# EAGLE schematic Stereopi Page 2 (EAGLE 9.6.2)
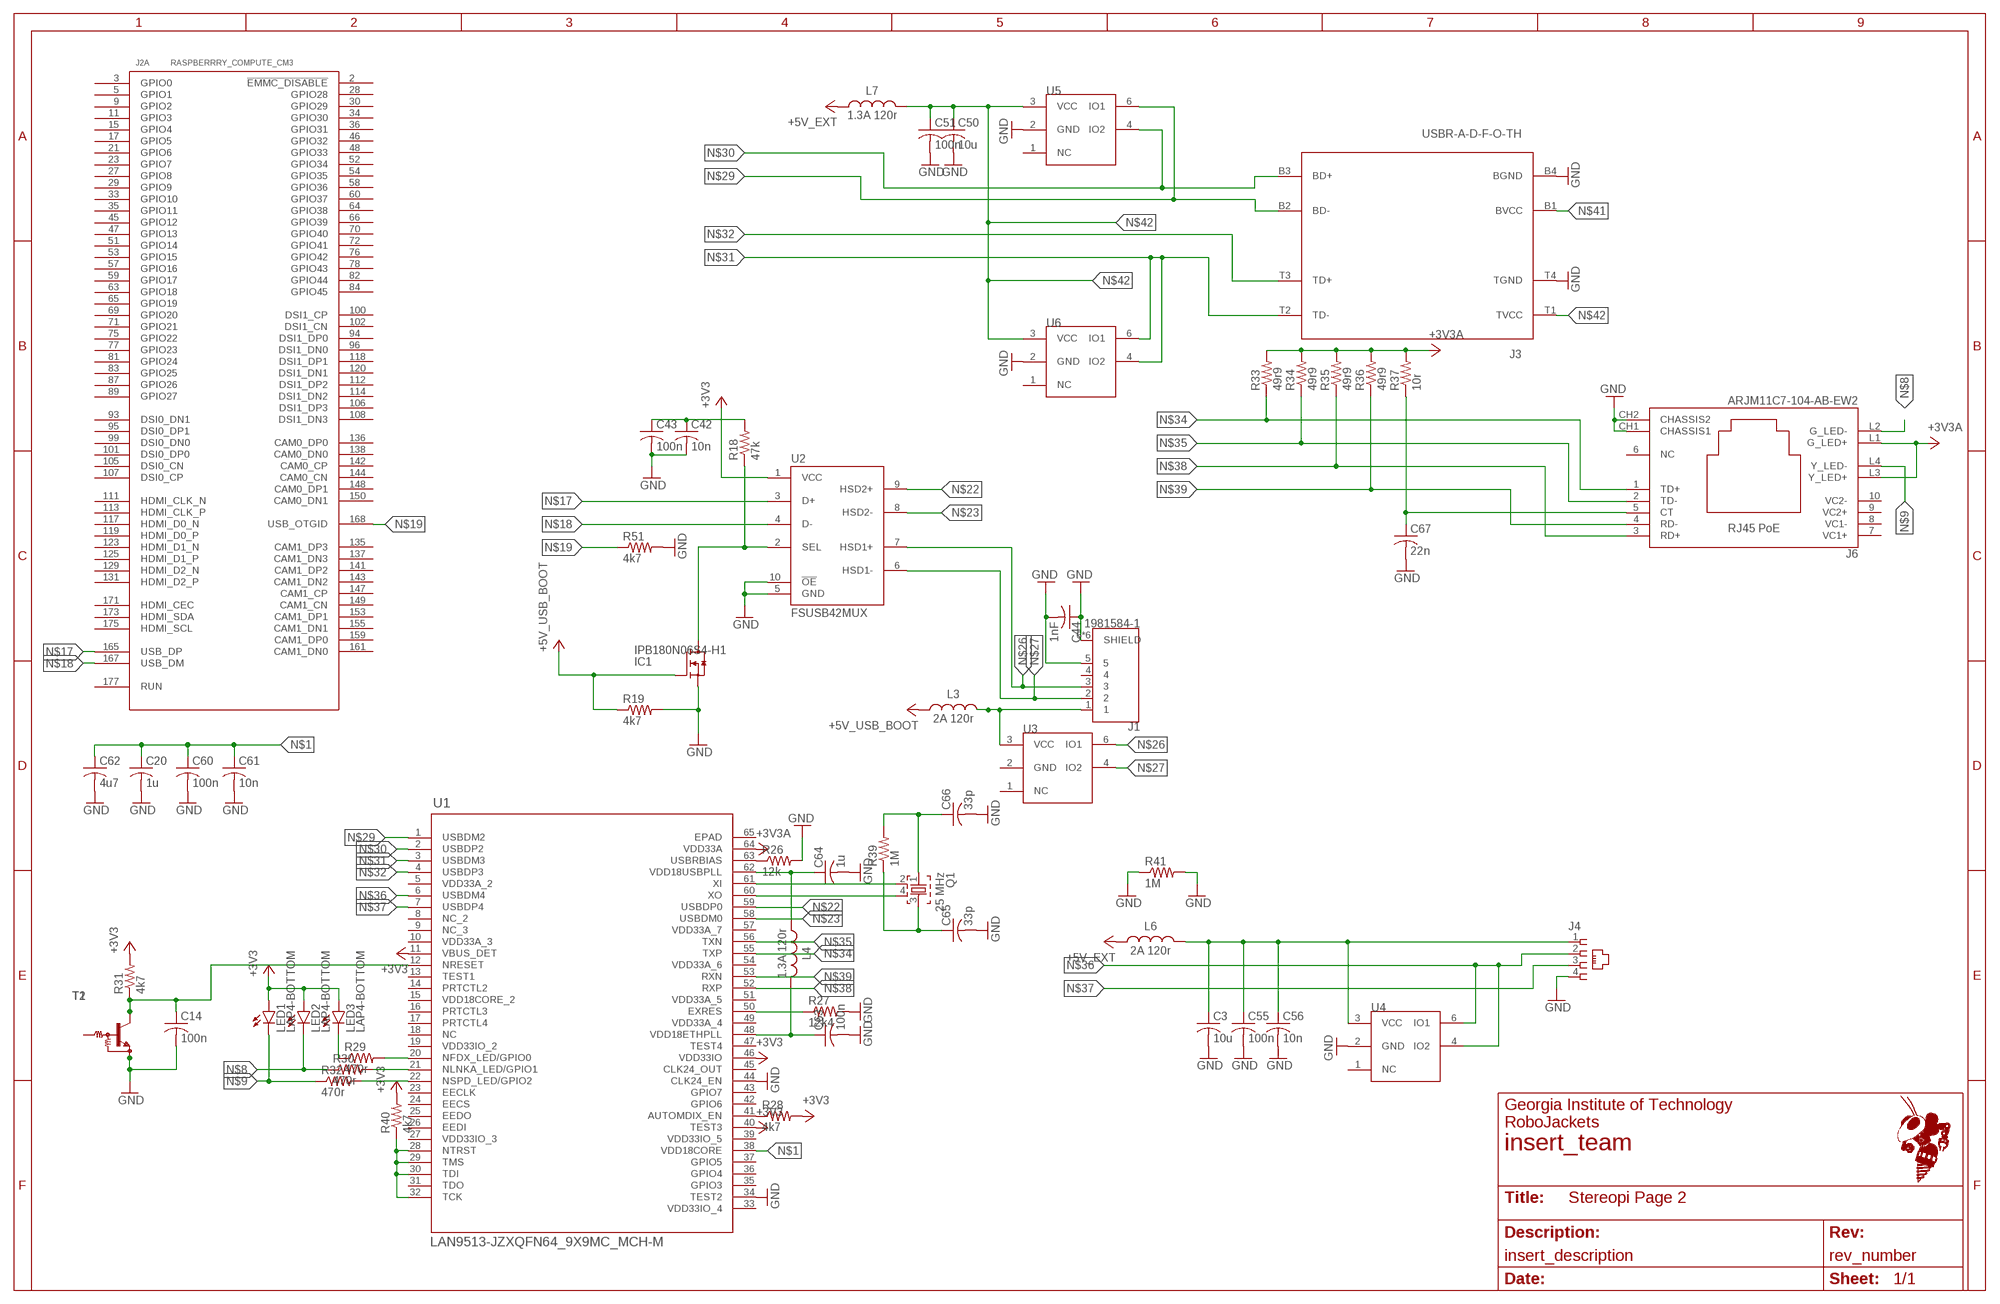
[diagram p0: schematic, sheet 1]
FRAME1 (FRAME_11_17): REVISION: rev_number; SCH_DESC: insert_description; TEAM: insert_team

## Parts
C3  10u  C-USC0402  [C0402]
C14  100n  C-USC0402  [C0402]
C20  1u  C-USC0402  [C0402]
C42  10n  C-USC0402  [C0402]
C43  100n  C-USC0402  [C0402]
C44  1nF  C-USC0402  [C0402]
C50  10u  C-USC0402  [C0402]
C51  100n  C-USC0402  [C0402]
C55  100n  C-USC0402  [C0402]
C56  10n  C-USC0402  [C0402]
C60  100n  C-USC0402  [C0402]
C61  10n  C-USC0402  [C0402]
C62  4u7  C-USC0402  [C0402]
C63  100n  C-USC0402  [C0402]
C64  1u  C-USC0402  [C0402]
C65  33p  C-USC0402  [C0402]
C66  33p  C-USC0402  [C0402]
C67  22n  C-USC0402  [C0402]
IC1  IPB180N06S4-H1  [PG-TO263-7-3]
J1  1981584-1  [TE_1981584-1]
J2  RASPBERRRY_COMPUTE_CM3  [TE_1473149-4_WITH_CM3PLUS]
J3  USBR-A-D-F-O-TH  [USBR-A-D-F-O-TH]
J4  215875-3  [215875-3]
J6  ARJM11C7-104-AB-EW2  [CONN_EW_ABR]
L3  2A 120r  INDUCTOR_0805  [0805]
L4  1.3A 120r  INDUCTOR_0805  [0805]
L6  2A 120r  INDUCTOR_0805  [0805]
L7  1.3A 120r  INDUCTOR_0805  [0805]
LED1  LAP4-BOTTOM  [P47F-BOTTOM]
LED2  LAP4-BOTTOM  [P47F-BOTTOM]
LED3  LAP4-BOTTOM  [P47F-BOTTOM]
Q1  25 MHz  FA-20H  [FA-20H]
R18  47k  ERJ-L06KF50MV  [RC0805N]
R19  4k7  ERJ-L06KF50MV  [RC0805N]
R26  12k  ERJ-L06KF50MV  [RC0805N]
R27  12k4  ERJ-L06KF50MV  [RC0805N]
R28  4k7  ERJ-L06KF50MV  [RC0805N]
R29  470r  ERJ-L06KF50MV  [RC0805N]
R30  470r  ERJ-L06KF50MV  [RC0805N]
R31  4k7  ERJ-L06KF50MV  [RC0805N]
R32  470r  ERJ-L06KF50MV  [RC0805N]
R33  49r9  ERJ-L06KF50MV  [RC0805N]
R34  49r9  ERJ-L06KF50MV  [RC0805N]
R35  49r9  ERJ-L06KF50MV  [RC0805N]
R36  49r9  ERJ-L06KF50MV  [RC0805N]
R37  10r  ERJ-L06KF50MV  [RC0805N]
R39  1M  ERJ-L06KF50MV  [RC0805N]
R40  4k7  ERJ-L06KF50MV  [RC0805N]
R41  1M  ERJ-L06KF50MV  [RC0805N]
R51  4k7  ERJ-L06KF50MV  [RC0805N]
T1  MUN2211T1-NPN_DRIVER-SC59-BEC  [SC59-BEC]
T2  MUN2211T1-NPN_DRIVER-SC59-BEC  [SC59-BEC]
U1  LAN9513-JZXQFN64_9X9MC_MCH-M  [QFN64_9X9MC_MCH-M]
U2  FSUSB42MUX  [10-MSOP]
U3  SP3003-02  [SC70-5]
U4  SP3003-02  [SC70-5]
U5  SP3003-02  [SC70-5]
U6  SP3003-02  [SC70-5]

## Nets
GND: C3.2 C14.2 C20.2 C42.2 C43.2 C44.1 C44.2 C50.2 C51.2 C55.2 C56.2 C60.2 C61.2 C62.2 C63.2 C64.2 C65.2 C66.2 C67.2 IC1.2(S) IC1.3(S) IC1.5(S) IC1.6(S) IC1.7(S) J1.5 J1.6(SHIELD) J1.7(SHIELD) J1.8(SHIELD) J1.9(SHIELD) J1.10(SHIELD) J1.11(SHIELD) J3.B4(BGND) J3.T4(TGND) J4.4 J6.CH1(CHASSIS1) J6.CH2(CHASSIS2) R19.2(PIN2) R26.2(PIN2) R27.2(PIN2) R41.1(PIN1) R41.2(PIN2) R51.2(PIN2) T1.E T2.E U1.34(TEST2) U1.44(CLK24_EN) U2.5(GND) U2.10(!OE) U4.2(GND) U5.2(GND) U6.2(GND)
N$1: C20.1 C60.1 C61.1 C62.1 U1.38(VDD18CORE)
N$2: C64.1 L4.1 U1.62(VDD18USBPLL)
N$3: C63.1 L4.2 U1.48(VDD18ETHPLL)
N$4: R29.2(PIN2) U1.20(NFDX_LED/GPIO0)
N$5: R30.2(PIN2) U1.21(NLNKA_LED/GPIO1)
N$6: R32.2(PIN2) U1.22(NSPD_LED/GPIO2)
N$7: LED3.C R29.1(PIN1)
N$8: J6.L2(G_LED-) LED2.C R30.1(PIN1)
N$9: J6.L4(Y_LED-) LED1.C R32.1(PIN1)
N$10: C14.1 R31.1(PIN1) T1.C T2.C U1.12(NRESET)
N$11: R40.1(PIN1) U1.28(NTRST) U1.29(TMS) U1.30(TDI) U1.32(TCK)
N$12: T1.B T2.B
N$13: Q1.2 U1.61(XI)
N$14: Q1.4 U1.60(XO)
N$15: C66.1 Q1.1 R39.2(PIN2)
N$16: C65.1 Q1.3 R39.1(PIN1)
N$17: J2.165(A:USB_DP) U2.3(D+)
N$18: J2.167(A:USB_DM) U2.4(D-)
N$19: J2.168(A:USB_OTGID) R51.1(PIN1)
N$20: R26.1(PIN1) U1.63(USBRBIAS)
N$21: IC1.8(D) R18.1(PIN1) U2.2(SEL)
N$22: U1.59(USBDP0) U2.9(HSD2+)
N$23: U1.58(USBDM0) U2.8(HSD2-)
N$24: R28.1(PIN1) U1.41(AUTOMDIX_EN)
N$25: R27.1(PIN1) U1.50(EXRES)
N$26: J1.3 U2.7(HSD1+) U3.6(IO1)
N$27: J1.2 U2.6(HSD1-) U3.4(IO2)
N$28: J1.1 L3.2 U3.3(VCC)
N$29: J3.B2(BD-) U1.1(USBDM2) U5.6(IO1)
N$30: J3.B3(BD+) U1.2(USBDP2) U5.4(IO2)
N$31: J3.T2(TD-) U1.3(USBDM3) U6.4(IO2) U6.6(IO1)
N$32: J3.T3(TD+) U1.4(USBDP3)
N$33: C3.1 C55.1 C56.1 J4.1 L6.2 U4.3(VCC)
N$34: J6.1(TD+) R33.1(PIN1) U1.55(TXP)
N$35: J6.2(TD-) R34.1(PIN1) U1.56(TXN)
N$36: J4.2 U1.6(USBDM4) U4.4(IO2) U4.6(IO1)
N$37: J4.3 U1.7(USBDP4)
N$38: J6.3(RD+) R35.1(PIN1) U1.52(RXP)
N$39: J6.4(RD-) R36.1(PIN1) U1.53(RXN)
N$40: C42.1 C43.1 R18.2(PIN2)
N$41: J3.B1(BVCC)
N$42: C50.1 C51.1 J3.T1(TVCC) L7.2 U5.3(VCC) U6.3(VCC)
N$46: C67.1 J6.5(CT) R37.1(PIN1)
VCC: IC1.1(G) J6.L1(G_LED+) J6.L3(Y_LED+) L3.1 L6.1 L7.1 LED1.A LED2.A LED3.A R19.1(PIN1) R28.2(PIN2) R31.2(PIN2) R33.2(PIN2) R34.2(PIN2) R35.2(PIN2) R36.2(PIN2) R37.2(PIN2) R40.2(PIN2) U1.11(VBUS_DET) U1.40(TEST3) U1.46(VDD33IO) U1.64(VDD33A) U2.1(VCC) ; supply symbol labelled +3V3, +3V3A, +5V_USB_BOOT, +5V_EXT
Unconnected: J1.4 J2.2(A:!EMMC_DISABLE) J2.3(A:GPIO0) J2.4(D:NC) J2.5(A:GPIO1) J2.6(D:NC) J2.9(A:GPIO2) J2.10(D:NC) J2.11(A:GPIO3) J2.12(D:NC) J2.15(A:GPIO4) J2.16(D:NC) J2.17(A:GPIO5) J2.18(D:NC) J2.21(A:GPIO6) J2.22(D:NC) J2.23(A:GPIO7) J2.24(D:NC) J2.27(A:GPIO8) J2.28(A:GPIO28) J2.29(A:GPIO9) J2.30(A:GPIO29) J2.33(A:GPIO10) J2.34(A:GPIO30) J2.35(A:GPIO11) J2.36(A:GPIO31) J2.45(A:GPIO12) J2.46(A:GPIO32) J2.47(A:GPIO13) J2.48(A:GPIO33) J2.51(A:GPIO14) J2.52(A:GPIO34) J2.53(A:GPIO15) J2.54(A:GPIO35) J2.57(A:GPIO16) J2.58(A:GPIO36) J2.59(A:GPIO17) J2.60(A:GPIO37) J2.63(A:GPIO18) J2.64(A:GPIO38) J2.65(A:GPIO19) J2.66(A:GPIO39) J2.69(A:GPIO20) J2.70(A:GPIO40) J2.71(A:GPIO21) J2.72(A:GPIO41) J2.75(A:GPIO22) J2.76(A:GPIO42) J2.77(A:GPIO23) J2.78(A:GPIO43) J2.81(A:GPIO24) J2.82(A:GPIO44) J2.83(A:GPIO25) J2.84(A:GPIO45) J2.87(A:GPIO26) J2.88(B:HDMI_HPD_N_1V8) J2.89(A:GPIO27) J2.90(B:EMMC_EN_N_1V8) J2.93(A:DSI0_DN1) J2.94(A:DSI1_DP0) J2.95(A:DSI0_DP1) J2.96(A:DSI1_DN0) J2.99(A:DSI0_DN0) J2.100(A:DSI1_CP) J2.101(A:DSI0_DP0) J2.102(A:DSI1_CN) J2.105(A:DSI0_CN) J2.106(A:DSI1_DP3) J2.107(A:DSI0_CP) J2.108(A:DSI1_DN3) J2.111(A:HDMI_CLK_N) J2.112(A:DSI1_DP2) J2.113(A:HDMI_CLK_P) J2.114(A:DSI1_DN2) J2.117(A:HDMI_D0_N) J2.118(A:DSI1_DP1) J2.119(A:HDMI_D0_P) J2.120(A:DSI1_DN1) J2.123(A:HDMI_D1_N) J2.124(D:NC) J2.125(A:HDMI_D1_P) J2.126(D:NC) J2.128(D:NC) J2.129(A:HDMI_D2_N) J2.130(D:NC) J2.131(A:HDMI_D2_P) J2.132(D:NC) J2.135(A:CAM1_DP3) J2.136(A:CAM0_DP0) J2.137(A:CAM1_DN3) J2.138(A:CAM0_DN0) J2.141(A:CAM1_DP2) J2.142(A:CAM0_CP) J2.143(A:CAM1_DN2) J2.144(A:CAM0_CN) J2.147(A:CAM1_CP) J2.148(A:CAM0_DP1) J2.149(A:CAM1_CN) J2.150(A:CAM0_DN1) J2.153(A:CAM1_DP1) J2.154(D:NC) J2.155(A:CAM1_DN1) J2.156(D:NC) J2.158(D:NC) J2.159(A:CAM1_DP0) J2.160(D:NC) J2.161(A:CAM1_DN0) J2.162(D:NC) J2.166(B:TVDAC) J2.171(A:HDMI_CEC) J2.172(B:VC_TRST_N) J2.173(A:HDMI_SDA) J2.174(B:VC_TDI) J2.175(A:HDMI_SCL) J2.176(B:VC_TMS) J2.177(A:RUN) J2.179(D:VDD_CORE_(DNC)) J2.MH1(C:MH1) J2.MH2(C:MH2) J6.6(NC) J6.7(VC1+) J6.8(VC1-) J6.9(VC2+) J6.10(VC2-) U1.8(NC_2) U1.9(NC_3) U1.13(TEST1) U1.14(PRTCTL2) U1.16(PRTCTL3) U1.17(PRTCTL4) U1.18(NC) U1.23(EECLK) U1.24(EECS) U1.25(EEDO) U1.26(EEDI) U1.31(TDO) U1.35(GPIO3) U1.36(GPIO4) U1.37(GPIO5) U1.42(GPIO6) U1.43(GPIO7) U1.45(CLK24_OUT) U1.47(TEST4) U1.65(EPAD) U3.1(NC) U4.1(NC) U5.1(NC) U6.1(NC)

## Power pins joined to a net without a drawn wire
1V8: J2.183(B:1V8) J2.184(B:1V8) J2.185(B:1V8) J2.186(B:1V8)
3V3: J2.191(B:3V3) J2.192(B:3V3) J2.193(B:3V3) J2.194(B:3V3)
GND: J2.1(C:GND) J2.7(C:GND) J2.8(C:GND) J2.13(C:GND) J2.14(C:GND) J2.19(C:GND) J2.20(C:GND) J2.25(C:GND) J2.26(C:GND) J2.31(C:GND) J2.32(C:GND) J2.37(C:GND) J2.38(C:GND) J2.43(C:GND) J2.44(C:GND) J2.49(C:GND) J2.50(C:GND) J2.55(C:GND) J2.56(C:GND) J2.61(C:GND) J2.62(C:GND) J2.67(C:GND) J2.68(C:GND) J2.73(C:GND) J2.74(C:GND) J2.79(C:GND) J2.80(C:GND) J2.85(C:GND) J2.86(C:GND) J2.91(C:GND) J2.92(C:GND) J2.97(C:GND) J2.98(C:GND) J2.103(C:GND) J2.104(C:GND) J2.109(C:GND) J2.110(C:GND) J2.115(C:GND) J2.116(C:GND) J2.121(C:GND) J2.122(C:GND) J2.127(C:GND) J2.133(C:GND) J2.134(C:GND) J2.139(C:GND) J2.140(C:GND) J2.145(C:GND) J2.146(C:GND) J2.151(C:GND) J2.152(C:GND) J2.157(C:GND) J2.163(C:GND) J2.164(C:GND) J2.169(C:GND) J2.170(C:GND) J2.181(C:GND) J2.182(C:GND) J2.187(C:GND) J2.188(C:GND) J2.195(C:GND) J2.196(C:GND) U3.2(GND)
GPIO0-27_VDD: J2.39(B:GPIO0-27_VDD) J2.40(B:GPIO0-27_VDD)
GPIO28-45_VDD: J2.41(B:GPIO28-45_VDD) J2.42(B:GPIO28-45_VDD)
VBAT: J2.197(B:VBAT) J2.198(B:VBAT) J2.199(B:VBAT) J2.200(B:VBAT)
VC_TCK: J2.180(B:VC_TCK)
VC_TDO: J2.178(B:VC_TDO)
VDAC: J2.189(B:VDAC) J2.190(B:VDAC)
VDD18CORE_2: U1.15(VDD18CORE_2)
VDD33A_2: U1.5(VDD33A_2)
VDD33A_3: U1.10(VDD33A_3)
VDD33A_4: U1.49(VDD33A_4)
VDD33A_5: U1.51(VDD33A_5)
VDD33A_6: U1.54(VDD33A_6)
VDD33A_7: U1.57(VDD33A_7)
VDD33IO_2: U1.19(VDD33IO_2)
VDD33IO_3: U1.27(VDD33IO_3)
VDD33IO_4: U1.33(VDD33IO_4)
VDD33IO_5: U1.39(VDD33IO_5)

## Library data of the parts
C3 C14 C20 C42-C44 C50 C51 C55 C56 C60-C67 = rcl:C-US: CAPACITOR, American symbol; SPICEPREFIX: C
IC1 = infineon:IPB180N06S4-H1: OptiMOS®-T2 Power-Transistor Source: 1859075.pdf (Farnell)
J1 = RoboJackets-Connectors:1981584-1: CONN RCPT MICRO USB TYPE AB https://www.digikey.com/product-detail/en/te-connectivity-amp-connectors/1981584-1/A97799TR-ND/1786247; CENTERLINE_PITCH: .65 mm[.025 in]; COMMENT: 1981584-1; DESCRIPTION: REC TYPE AB ASSY _Au_ MICRO USB; DIGI-KEY_PART_NUMBER: A97799CT-ND; DIGI-KEY_PURCHASE_URL: https://www.digikey.com/product-detail/en/te-connectivity-amp-connectors/1981584-1/A97799CT-ND/1786249?utm_source=snapeda&utm_medium=aggregator&utm_campaign=symbol; MF: TE Connectivity; MP: 1981584-1; NUMBER_OF_POSITIONS: 5; PACKAGE: None; PRODUCT_TYPE: Connector; TE_PURCHASE_URL: https://www.te.com/usa-en/product-1981584-1.html?te_bu=Cor&te_type=disp&te_campaign=seda_glo_cor-seda-global-disp-prtnr-fy19-seda-model-bom-cta_sma-317_1&elqCampaignId=32493
J2 = distributed-vision:RASPBERRRY_COMPUTE_CM3: RASPBERRY PI COMPUTE 3+ 16GB; DKPN: 1690-1031-ND
J3 = distributed-vision:USBR-A-D-F-O-TH: USB-A (USB TYPE-A) USB 2.0 Receptacle Connector 8 Position Through Hole, Right Angle; DKPN: SAM10376-ND
J4 = con-amp:215875-3: AMP connector
J6 = ethernet_poe_v2.1:ARJM11C7-104-AB-EW2: 1 Port RJ45 Magjack Connector Through Hole 10/100 Base-T, AutoMDIX, Power over Ethernet (PoE); DKPN: 535-14148-ND
L3 L4 L6 L7 = RoboJackets-Inductors:INDUCTOR_0805: Generic 0805 Inductor
LED1-LED3 = led:*P4: PointLED® Enhanced Thinfilm LED TOP & BOTTOM mount LS P47F, LR P47F, LA P47F, LY P47F, LT P4SG, LB P4SG, LW P4SG Source: http://catalog.osram-os.com .. LA_LR_LS_LY_P47F_Pb_free.pdf
Q1 = crystal:FA-: MHz RANGE CRYSTAL UNIT Source: Epson Toyocom
R18 R19 R26-R37 R39-R41 R51 = RoboJackets-Resistors:ERJ-L06KF50MV: Current Sensing Resistor Datasheet <https://industrial.panasonic.com/cdbs/www-data/pdf/RDN0000/AOA0000C313.pdf>; DKPN: P50LLCT-ND
T1 T2 = transistor:*-NPN_DRIVER-: NPN Bias Resistor Transistor
U1 = distributed-vision:LAN9513-JZX: USB to Ethernet. Datasheet link: https://ww1.microchip.com/downloads/en/DeviceDoc/00002305A.pdf; DKPN: LAN9513-JZX-ND
U2 = distributed-vision:FSUSB42MUX: USB Switch IC Channel 10-MSOP; DKPN: FSUSB42MUXCT-ND
U3-U6 = distributed-vision:SP3003-02: TVS DIODE ARRAY; DKPN: F3302CT-ND